# EAGLE schematic BarBot_Beacon (EAGLE 8.0.1)
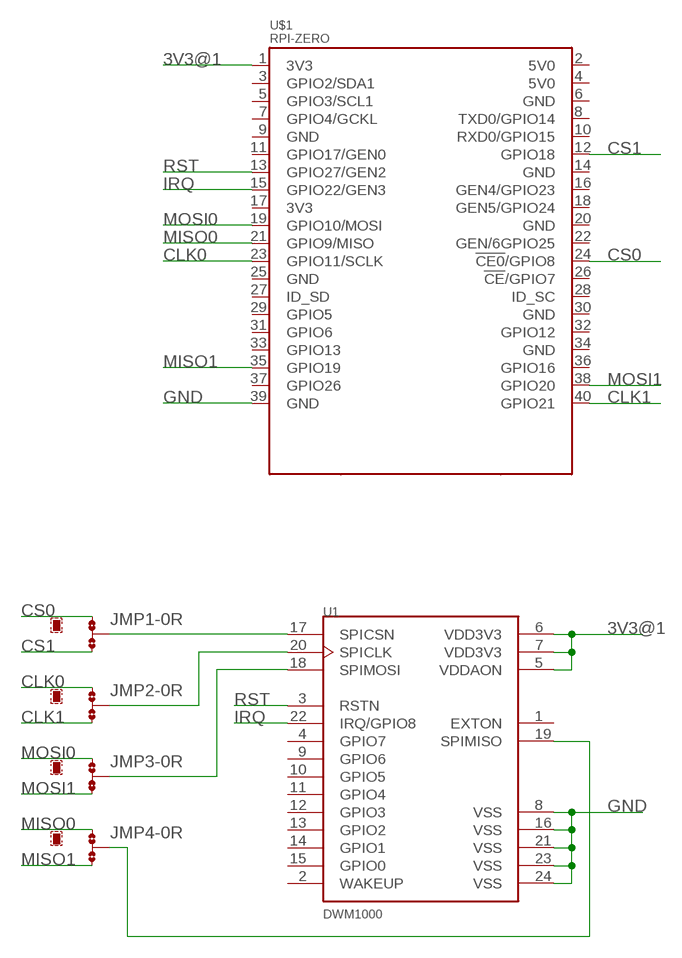
[diagram p0: schematic, sheet 1]

## Parts
JMP1  0R-JUMPA  [A0R-JMP]
JMP2  0R-JUMPA  [A0R-JMP]
JMP3  0R-JUMPA  [A0R-JMP]
JMP4  0R-JUMPA  [A0R-JMP]
U1  DWM1000  [XCVR_DWM1000]
U$1  RPI-ZERO  [RASPBERRYPI_BASTELSTUBE_V13_RASPI_BOARD_B+_FULL]

## Nets
3V3@1: U1.5(VDDAON) U1.6(VDD3V3) U1.7(VDD3V3) U$1.1(3V3)
CLK0: JMP2.1 U$1.23(GPIO11/SCLK)
CLK1: JMP2.3 U$1.40(GPIO21)
CS0: JMP1.1 U$1.24(!CE0!/GPIO8)
CS1: JMP1.3 U$1.12(GPIO18)
GND: U1.8(VSS) U1.16(VSS) U1.21(VSS) U1.23(VSS) U1.24(VSS) U$1.39(GND)
IRQ: U1.22(IRQ/GPIO8) U$1.15(GPIO22/GEN3)
MISO0: JMP4.1 U$1.21(GPIO9/MISO)
MISO1: JMP4.3 U$1.35(GPIO19)
MOSI0: JMP3.1 U$1.19(GPIO10/MOSI)
MOSI1: JMP3.3 U$1.38(GPIO20)
N$3: JMP1.2 U1.17(SPICSN)
N$4: JMP2.2 U1.20(SPICLK)
N$5: JMP3.2 U1.18(SPIMOSI)
N$6: JMP4.2 U1.19(SPIMISO)
RST: U1.3(RSTN) U$1.13(GPIO27/GEN2)
Unconnected: U1.1(EXTON) U1.2(WAKEUP) U1.4(GPIO7) U1.9(GPIO6) U1.10(GPIO5) U1.11(GPIO4) U1.12(GPIO3) U1.13(GPIO2) U1.14(GPIO1) U1.15(GPIO0) U$1.2(5V0) U$1.3(GPIO2/SDA1) U$1.4(5V0) U$1.5(GPIO3/SCL1) U$1.6(GND) U$1.7(GPIO4/GCKL) U$1.8(TXD0/GPIO14) U$1.9(GND) U$1.10(RXD0/GPIO15) U$1.11(GPIO17/GEN0) U$1.14(GND) U$1.16(GEN4/GPIO23) U$1.17(3V3) U$1.18(GEN5/GPIO24) U$1.20(GND) U$1.22(GEN/6GPIO25) U$1.25(GND) U$1.26(!CE!/GPIO7) U$1.27(ID_SD) U$1.28(ID_SC) U$1.29(GPIO5) U$1.30(GND) U$1.31(GPIO6) U$1.32(GPIO12) U$1.33(GPIO13) U$1.34(GND) U$1.36(GPIO16) U$1.37(GPIO26)

## Library data of the parts
JMP1-JMP4 = jump-0r-smd:0R-JUMP: SMD 0R 0805 Jumper
U1 = DWM1000:DWM1000: Mod Ieee802.15.4-2011 Uwb Txrx; AVAILABILITY: Good; DESCRIPTION: Mod Ieee802.15.4-2011 Uwb Txrx; MF: Decawave; MP: DWM1000; PACKAGE: None; PRICE: 23.36 USD
U$1 = RPI-Zero:RPI-ZERO